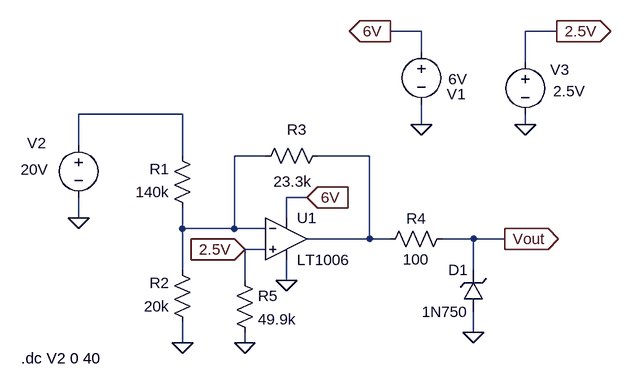
[diagram p0: schematic voltage_mon.asc]
voltage_mon.asc, the LTspice schematic file:
Version 4
SHEET 1 880 680
WIRE 336 -128 288 -128
WIRE 544 -128 496 -128
WIRE 336 -96 336 -128
WIRE 496 -80 496 -128
WIRE -32 0 -192 0
WIRE 336 16 336 -16
WIRE 496 16 496 0
WIRE -192 48 -192 0
WIRE -32 64 -32 0
WIRE 96 64 48 64
WIRE 256 64 176 64
WIRE 160 128 128 128
WIRE -192 160 -192 128
WIRE 128 160 128 128
WIRE -32 176 -32 144
WIRE 48 176 48 64
WIRE 48 176 -32 176
WIRE 96 176 48 176
WIRE 256 192 256 64
WIRE 256 192 160 192
WIRE 288 192 256 192
WIRE 416 192 368 192
WIRE 464 192 416 192
WIRE 96 208 64 208
WIRE -32 240 -32 176
WIRE 416 240 416 192
WIRE 64 256 64 208
WIRE 128 256 128 224
WIRE 416 336 416 304
WIRE -32 352 -32 320
WIRE 64 352 64 336
FLAG 336 16 0
FLAG 128 256 0
FLAG -32 352 0
FLAG -192 160 0
FLAG 416 336 0
FLAG 464 192 Vout
IOPIN 464 192 Out
FLAG 288 -128 6V
IOPIN 288 -128 Out
FLAG 160 128 6V
IOPIN 160 128 In
FLAG 64 352 0
FLAG 496 16 0
FLAG 544 -128 2.5V
IOPIN 544 -128 Out
FLAG 64 208 2.5V
IOPIN 64 208 In
SYMBOL Opamps\\LT1006 128 128 R0
SYMATTR InstName U1
SYMBOL voltage 336 -112 R0
WINDOW 0 39 81 Left 2
WINDOW 3 41 58 Left 2
WINDOW 123 0 0 Left 2
WINDOW 39 0 0 Left 2
SYMATTR InstName V1
SYMATTR Value 6V
SYMBOL res -16 160 R180
WINDOW 0 36 76 Left 2
WINDOW 3 36 40 Left 2
SYMATTR InstName R1
SYMATTR Value 140k
SYMBOL res -16 336 R180
WINDOW 0 36 76 Left 2
WINDOW 3 36 40 Left 2
SYMATTR InstName R2
SYMATTR Value 20k
SYMBOL res 80 80 R270
WINDOW 0 41 64 VTop 2
WINDOW 3 -8 58 VBottom 2
SYMATTR InstName R3
SYMATTR Value 23.3k
SYMBOL voltage -192 32 R0
WINDOW 0 -79 12 Left 2
WINDOW 3 -89 53 Left 2
WINDOW 123 0 0 Left 2
WINDOW 39 0 0 Left 2
SYMATTR InstName V2
SYMATTR Value 20V
SYMBOL res 384 176 R90
WINDOW 0 0 56 VBottom 2
WINDOW 3 32 56 VTop 2
SYMATTR InstName R4
SYMATTR Value 100
SYMBOL zener 432 304 R180
WINDOW 0 24 64 Left 2
WINDOW 3 24 0 Left 2
SYMATTR InstName D1
SYMATTR Value 1N750
SYMBOL res 48 240 R0
SYMATTR InstName R5
SYMATTR Value 49.9k
SYMBOL voltage 496 -96 R0
WINDOW 0 38 27 Left 2
WINDOW 3 43 60 Left 2
WINDOW 123 0 0 Left 2
WINDOW 39 0 0 Left 2
SYMATTR InstName V3
SYMATTR Value 2.5V
TEXT -280 376 Left 2 !.dc V2 0 40

The netlist it stands for:
* voltage_mon.asc
XU1 2.5V N002 6V 0 N003 LT1006  ; pins In+ In- V+ V- OUT
V1 6V 0 6V
R1 N002 N001 140k
R2 0 N002 20k
R3 N002 N003 23.3k
V2 N001 0 20V
R4 Vout N003 100
D1 0 Vout 1N750
R5 2.5V 0 49.9k
V3 2.5V 0 2.5V
.model D D
.lib standard.dio
.dc V2 0 40
.lib LTC.lib
.backanno
.end